# Altium schematic sheet LM709_schematic.SchDoc
size A; SheetNumber: 1; SheetTotal: 1
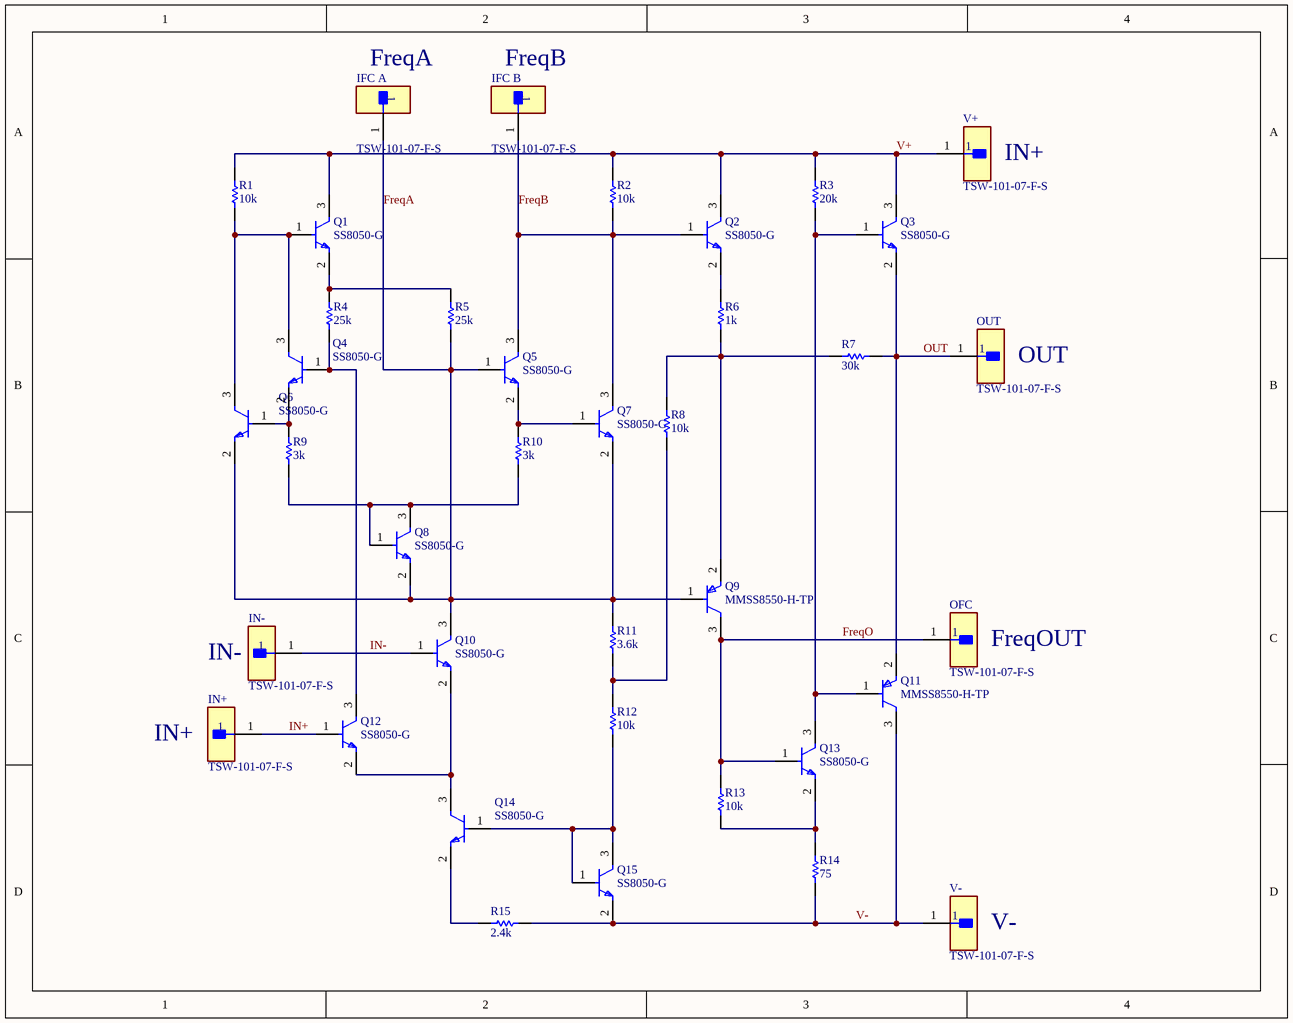
[diagram p0: LM709_schematic.SchDoc]

## Parts
IFC_A  TSW-101-07-F-S  [FP-TSW-101-07-F-S-MFG]
IFC_B  TSW-101-07-F-S  [FP-TSW-101-07-F-S-MFG]
IN+  TSW-101-07-F-S  [FP-TSW-101-07-F-S-MFG]
IN-  TSW-101-07-F-S  [FP-TSW-101-07-F-S-MFG]
OFC  TSW-101-07-F-S  [FP-TSW-101-07-F-S-MFG]
OUT  TSW-101-07-F-S  [FP-TSW-101-07-F-S-MFG]
Q1  SS8050-G  [FP-SS8050-G-MFG]
Q2  SS8050-G  [FP-SS8050-G-MFG]
Q3  SS8050-G  [FP-SS8050-G-MFG]
Q4  SS8050-G  [FP-SS8050-G-MFG]
Q5  SS8050-G  [FP-SS8050-G-MFG]
Q6  SS8050-G  [FP-SS8050-G-MFG]
Q7  SS8050-G  [FP-SS8050-G-MFG]
Q8  SS8050-G  [FP-SS8050-G-MFG]
Q9  MMSS8550-H-TP  [FP-SOT-23-IPC_B]
Q10  SS8050-G  [FP-SS8050-G-MFG]
Q11  MMSS8550-H-TP  [FP-SOT-23-IPC_B]
Q12  SS8050-G  [FP-SS8050-G-MFG]
Q13  SS8050-G  [FP-SS8050-G-MFG]
Q14  SS8050-G  [FP-SS8050-G-MFG]
Q15  SS8050-G  [FP-SS8050-G-MFG]
R1  10k  [RESC2013X60X35ML10T20]
R2  10k  [RESC2013X60X35ML10T20]
R3  20k  [RESC2013X60X35ML10T20]
R4  25k  [RESC2013X60X35ML10T20]
R5  25k  [RESC2013X60X35ML10T20]
R6  1k  [RESC2013X60X35ML10T20]
R7  30k  [RESC2013X60X35ML10T20]
R8  10k  [RESC2013X60X35ML10T20]
R9  3k  [RESC2013X60X35ML10T20]
R10  3k  [RESC2013X60X35ML10T20]
R11  3.6k  [RESC2013X60X35ML10T20]
R12  10k  [RESC2013X60X35ML10T20]
R13  10k  [RESC2013X60X35ML10T20]
R14  75  [RESC2013X60X35ML10T20]
R15  2.4k  [RESC2013X60X35ML10T20]
V+  TSW-101-07-F-S  [FP-TSW-101-07-F-S-MFG]
V-  TSW-101-07-F-S  [FP-TSW-101-07-F-S-MFG]

## Nets
FreqA: IFC_A.1 Q5.1(B) Q6.2(E) Q7.2(E) Q8.2(E) Q9.1(B) Q10.3(C) R5.1 R11.2
FreqB: IFC_B.1 Q2.1(B) Q5.3(C) Q7.3(C) R2.1
FreqO: OFC.1 Q9.3(C) Q13.1(B) R13.2
IN+: IN+.1 Q12.1(B)
IN-: IN-.1 Q10.1(B)
OUT: OUT.1 Q3.2(E) Q11.2(E) R7.1
V+: Q1.3(C) Q2.3(C) Q3.3(C) R1.2 R2.2 R3.2 V+.1
V-: Q11.3(C) Q15.2(E) R14.1 R15.2 V-.1
NetQ1_1: Q1.1(B) Q4.3(C) Q6.3(C) R1.1
NetQ1_2: Q1.2(E) R4.2 R5.2
NetQ2_2: Q2.2(E) R6.2
NetQ3_1: Q3.1(B) Q11.1(B) Q13.3(C) R3.1
NetQ4_1: Q4.1(B) Q12.3(C) R4.1
NetQ4_2: Q4.2(E) Q6.1(B) R9.2
NetQ5_2: Q5.2(E) Q7.1(B) R10.2
NetQ8_1: Q8.1(B) Q8.3(C) R9.1 R10.1
NetQ9_2: Q9.2(E) R6.1 R7.2 R8.2
NetQ10_2: Q10.2(E) Q12.2(E) Q14.3(C)
NetQ13_2: Q13.2(E) R13.1 R14.2
NetQ14_1: Q14.1(B) Q15.1(B) Q15.3(C) R12.1
NetQ14_2: Q14.2(E) R15.1
NetR8_1: R8.1 R11.1 R12.2

## Notes on the sheet
- (near IFC_A) FreqA
- (near IFC_B) FreqB
- (near V+) IN+
- (near OUT) OUT
- (near IN-) IN-
- (near OFC) FreqOUT
- (near IN+) IN+
- (near V-) V-

## Library data of the parts
IFC_A IFC_B IN+ IN- OFC OUT V+ V- = CMP-02766-001403-1: CONN HEADER VERT 1POS; Number of Positions: 1; Gender: Male; Contact Material: Bronze; Number of Rows: 1; Termination: Solder; Insulation Material: PBT; Number of Contacts: 1; Min Operating Temperature: -55°C; RoHS Compliant: Yes; Contact Plating: Gold; Contact Shape: Square; Max Operating Temperature: 125°C; Flammability Rating: UL94 V-0; Series: TSW; Connector Type: Header; Packaging: Bulk; Radiation Hardening: No; Insulation Color: Black; Mount: Through Hole; Contact Type: Male Pin; REACH SVHC: No SVHC; Contact Finish - Mating: GOLD; Fastening Type: Pull
Q1-Q8 Q10 Q12-Q15 = CMP-20235-000001-1: NPN TRANSISTOR 1.5A 40V SOT-23 R; Transition Frequency: 100MHz; Max Breakdown Voltage: 25V; Collector Emitter Voltage (VCEO): 400mV; Max Power Dissipation: 300mW; Max Collector Current: 1.5A; Case/Package: TO-236-3; Packaging: Tape and Reel; RoHS Compliant: Yes; Mount: Surface Mount; Collector Emitter Breakdown Voltage: 25V
Q9 Q11 = CMP-56214-000002-1: TRANS PNP 25V 1.5A SOT23; Emitter Base Voltage (VEBO): 1.6V; Collector Base Voltage (VCBO): 40V; Collector Emitter Saturation Voltage: 500mV; Max Power Dissipation: 625mW; Transition Frequency: 100MHz; Element Configuration: Single; hFE Min: 40; Polarity: PNP; Lead Free: Lead Free; Max Breakdown Voltage: 25V; Package Quantity: 1; Min Operating Temperature: -55°C; Case/Package: SOT-23; Max Collector Current: 1.5A; Mount: Surface Mount; Packaging: Tape and Reel; Collector Emitter Voltage (VCEO): 500mV; Max Operating Temperature: 150°C; Gain Bandwidth Product: 100MHz; Collector Emitter Breakdown Voltage: 25V
R1-R15 = CMP-2100-03671-1: Chip Resistor, 1 KOhm, +/- 1%, 125 mW, -55 to 155 degC, 0805 (2012 Metric), RoHS, Tape and Reel; Manufacturer: Yageo; Temperature Coefficient: 100ppm/degreesC; Voltage Rating (DC): 150V; Max Power Dissipation: 125mW; Resistance: 1KOhm; Number of Pins: 2; Number of Terminations: 2; Datasheet URL: http://www.yageo.com/NewPortal/yageodocoutput?fileName=/pdf/R-Chip/PYu-RC_Group_51_RoHS_L_5.pdf; Length: 0.079inch; Package Description: 2-Pin Surface Mounted Device, Body 2 x 1.25 mm; Depth: 1.25mm; Height: 0.024inch; Military Standard: Not; Case/Package: 0805; Package Reference: 0805; RoHSCompliant: true; Lead Free: LeadFree; Packaging: TapeandReel; Package Quantity: 1; Datasheet Version: Rev. 5, 10/2016; Tolerance: 1%; Min Operating Temperature: -55degC; Voltage Rating: 150V; Composition: ThickFilm; Case Code (Imperial): 0805; Power Rating: 125mW; Width: 0.049inch; Case Code (Metric): 2012; Manufacturer URL: http://www.yageo.com/; Max Operating Temperature: 155degC; REACH SVHC: Unknown; Termination: SMD/SMT